# Altium schematic sheet PEAK_PDB.SchDoc
size A; SheetNumber: 1; SheetTotal: 1
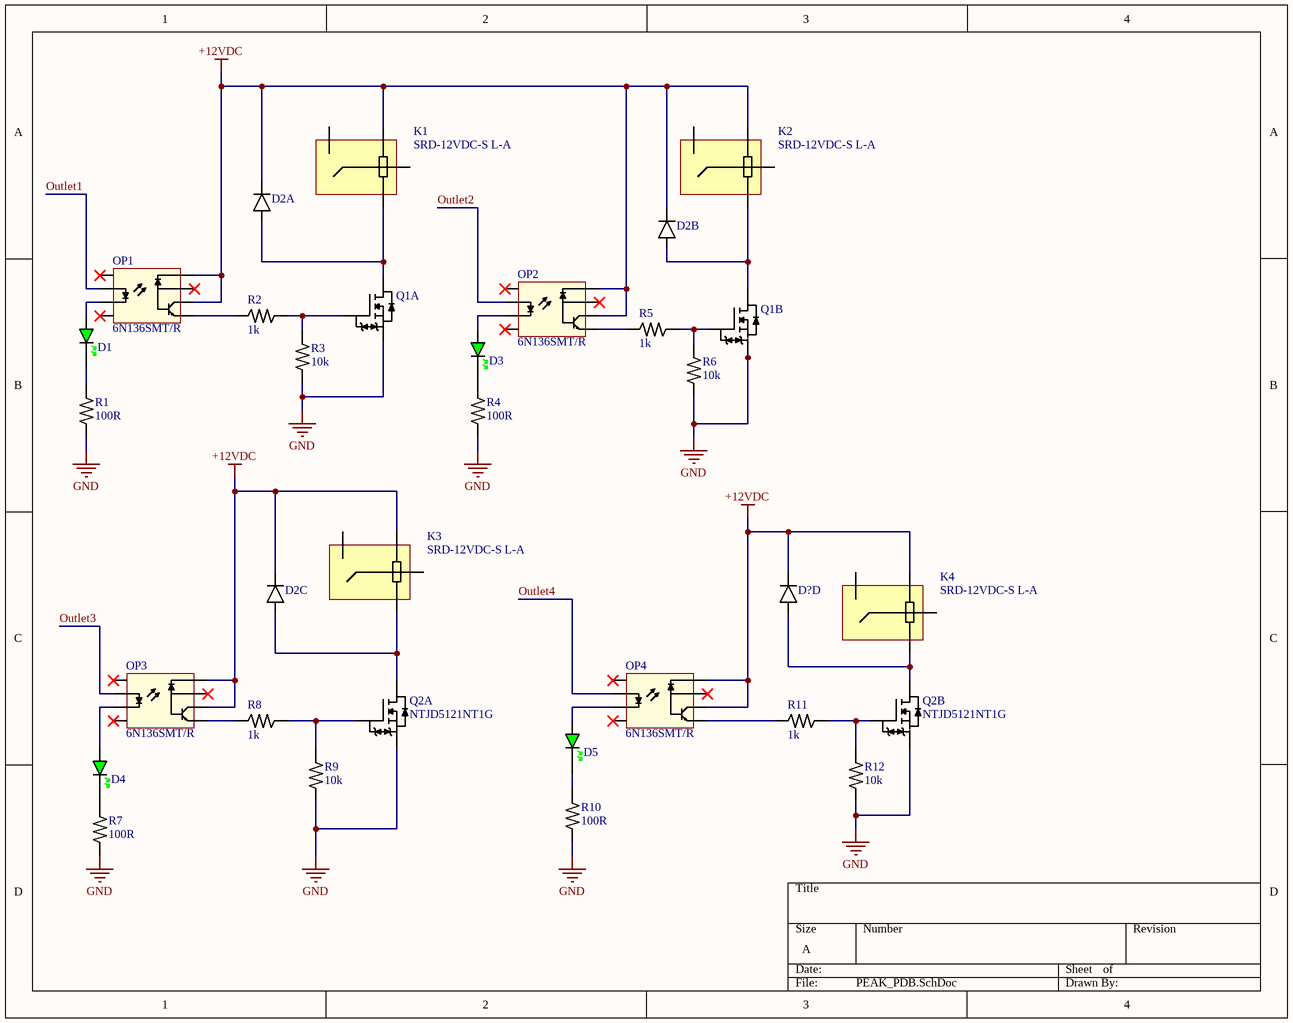
[diagram p0: PEAK_PDB.SchDoc]

## Parts
D1  GREEN  [LED_0402_GREEN]  (value not drawn)
D2  BAT54CDW-7-F  (value not drawn)  (parts A,B,C of 4)
D3  GREEN  [LED_0402_GREEN]  (value not drawn)
D4  GREEN  [LED_0402_GREEN]  (value not drawn)
D5  GREEN  [LED_0402_GREEN]  (value not drawn)
D?  BAT54CDW-7-F  (value not drawn)  (part D of 4)
K1  SRD-12VDC-S L-A  [SRD-12VDC-S L]
K2  SRD-12VDC-S L-A  [SRD-12VDC-S L]
K3  SRD-12VDC-S L-A  [SRD-12VDC-S L]
K4  SRD-12VDC-S L-A  [SRD-12VDC-S L]
OP1  6N136SMT/R  [SOP-8-2.54mm]
OP2  6N136SMT/R  [SOP-8-2.54mm]
OP3  6N136SMT/R  [SOP-8-2.54mm]
OP4  6N136SMT/R  [SOP-8-2.54mm]
Q1  NTJD5121NT1G  [SOT-363]  (value not drawn)  (parts A,B of 2)
Q2  NTJD5121NT1G  [SOT-363]  (parts A,B of 2)
R1  100R  [RES_0402]
R2  1k  [RES_0402]
R3  10k  [RES_0402]
R4  100R  [RES_0402]
R5  1k  [RES_0402]
R6  10k  [RES_0402]
R7  100R  [RES_0402]
R8  1k  [RES_0402]
R9  10k  [RES_0402]
R10  100R  [RES_0402]
R11  1k  [RES_0402]
R12  10k  [RES_0402]

## Nets
+12VDC: D2.1(C1) D2.4(C2) D?.4(C2) K1.4 K2.4 K3.4 K4.4 OP1.6(Vo) OP1.8(Vcc) OP2.6(Vo) OP2.8(Vcc) OP3.6(Vo) OP3.8(Vcc) OP4.6(Vo) OP4.8(Vcc)
GND: Q1.3(S1) Q1.6(S2) Q2.3(S1) Q2.6(S2) R1.1 R3.1 R4.1 R6.1 R7.1 R9.1 R10.1 R12.1
Outlet1: OP1.2(A)
Outlet2: OP2.2(A)
Outlet3: OP3.2(A)
Outlet4: OP4.2(A)
NetD1_A: D1.A OP1.3(C)
NetD1_K: D1.K R1.2
NetD2_2: D2.2(A2_1) K3.2 Q2.1(D1)
NetD2_5: D2.5(A1_1) K1.2 Q1.1(D1)
NetD2_6: D2.6(A1_2) K2.2 Q1.4(D2)
NetD3_A: D3.A OP2.3(C)
NetD3_K: D3.K R4.2
NetD4_A: D4.A OP3.3(C)
NetD4_K: D4.K R7.2
NetD5_A: D5.A OP4.3(C)
NetD5_K: D5.K R10.2
NetD?_3: D?.3(A2_2) K4.2 Q2.4(D2)
NetOP1_5: OP1.5(GND) R2.1
NetOP2_5: OP2.5(GND) R5.1
NetOP3_5: OP3.5(GND) R8.1
NetOP4_5: OP4.5(GND) R11.1
NetQ1_2: Q1.2(G1) R2.2 R3.2
NetQ1_5: Q1.5(G2) R5.2 R6.2
NetQ2_2: Q2.2(G1) R8.2 R9.2
NetQ2_5: Q2.5(G2) R11.2 R12.2

Not connected (* = marked no-connect by the designer): K1 1 3; K2 1 3; K3 1 3; K4 1 3; OP1 1(NC)* 4(NC)* 7(Vb)*; OP2 1(NC)* 4(NC)* 7(Vb)*; OP3 1(NC)* 4(NC)* 7(Vb)*; OP4 1(NC)* 4(NC)* 7(Vb)*

## Library data of the parts
D1 D3-D5 = LED_0402_GREEN: LED 0402 GREEN SMD
D2 D? = BAT54CDW-7-F: 2 Pairs of Common Cathode Diodes in SOT363 Package BAT54CDW-7-F
OP1-OP4 = 6N136SMT/R: Optocouplers SMD-8 RoHS. SOP-8-2.54mm Package
Q1 Q2 = NTJD5121NT1G: 2 NMOSFETs SOT-363
R1-R12 = RES_0402: Resistor SMD 0402 (0.0625W)